# Altium schematic sheet RotaryEncoder_connection.SchDoc
size C; SheetNumber: 2; SheetTotal: 2
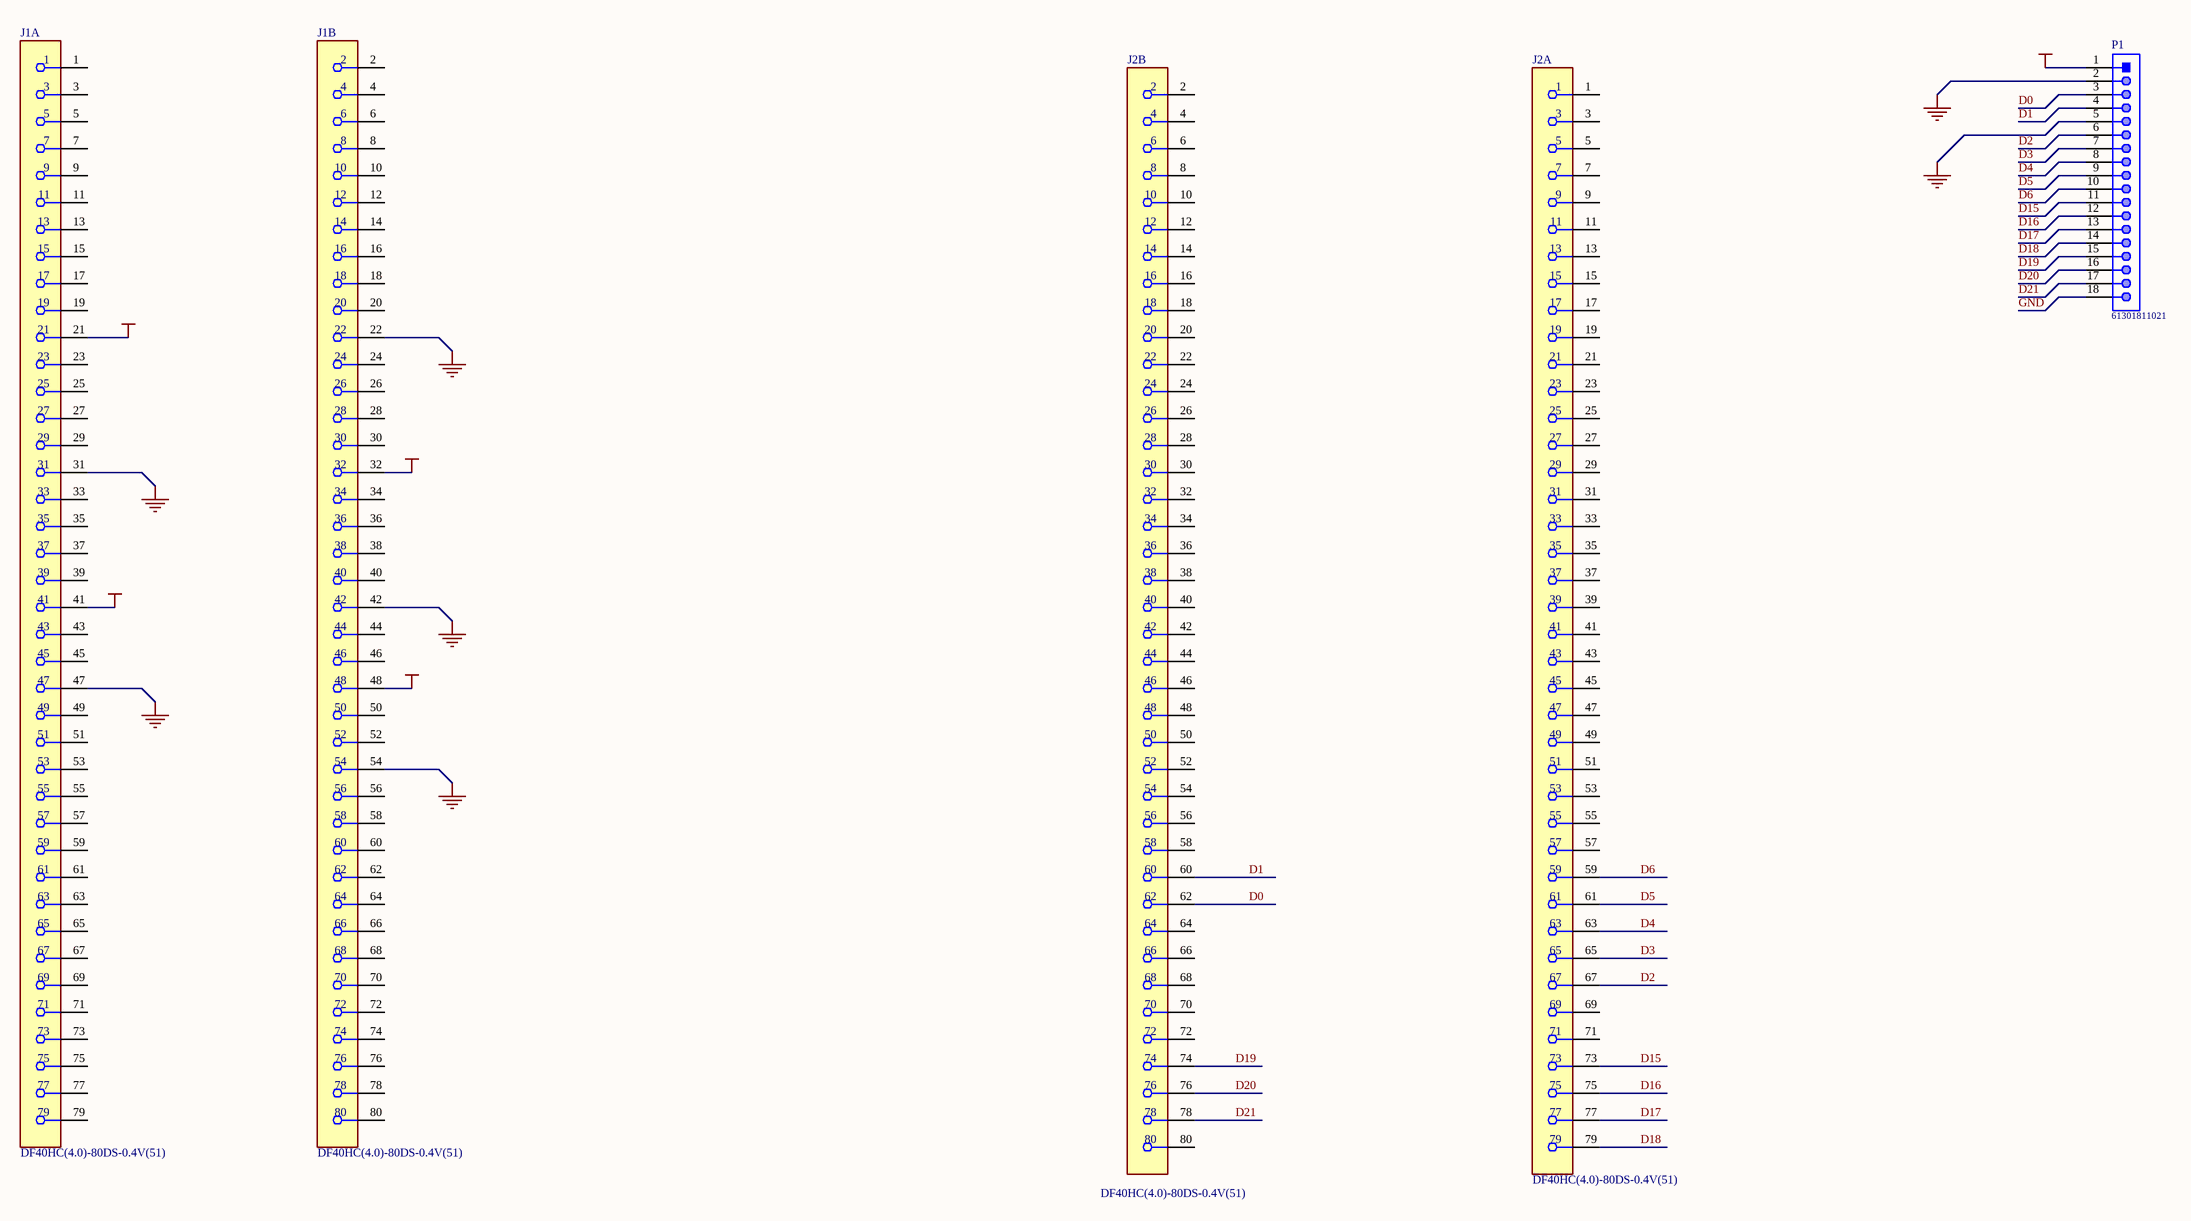
[diagram p0: RotaryEncoder_connection.SchDoc]

## Parts
J1  DF40HC(4.0)-80DS-0.4V(51)  [FP-DF40HC_4_0_-80DS-0_4V-MFG]  (parts A,B of 2)
J2  DF40HC(4.0)-80DS-0.4V(51)  [FP-DF40HC_4_0_-80DS-0_4V-MFG]  (parts A,B of 2)
P1  61301811021  [61301811021]

## Nets
+5: J1.21 J1.32 J1.41 J1.48 P1.1
GND: J1.22 J1.31 J1.42 J1.47 J1.54 P1.2 P1.5 P1.18
D0: J2.62 P1.3
D1: J2.60 P1.4
D2: J2.67 P1.6
D3: J2.65 P1.7
D4: J2.63 P1.8
D5: J2.61 P1.9
D6: J2.59 P1.10
D15: J2.73 P1.11
D16: J2.75 P1.12
D17: J2.77 P1.13
D18: J2.79 P1.14
D19: J2.74 P1.15
D20: J2.76 P1.16
D21: J2.78 P1.17

Not connected (* = marked no-connect by the designer): J1 1 2 3 4 5 6 7 8 9 10 11 12 13 14 15 16 17 18 19 20 23 24 25 26 27 28 29 30 33 34 35 36 37 38 39 40 43 44 45 46 49 50 51 52 53 55 56 57 58 59 60 61 62 63 64 65 66 67 68 69 70 71 72 73 74 75 76 77 78 79 80; J2 1 2 3 4 5 6 7 8 9 10 11 12 13 14 15 16 17 18 19 20 21 22 23 24 25 26 27 28 29 30 31 32 33 34 35 36 37 38 39 40 41 42 43 44 45 46 47 48 49 50 51 52 53 54 55 56 57 58 64 66 68 69 70 71 72 80

## Library data of the parts
J1 J2 = CMP-11605-000021-1: CONN RCPT 80POS SMD GOLD; Manufacturer: Hirose; Current Rating: 0.3A; Is Female: yes; Conn Orientation: Straight; Conn Gender: Female; Standoff Height: 0mm; Number Of Contacts: 80; Pitch: 0.4mm; Voltage Rating: 30V; Lead Free: Yes; Device Class L2: Board to Board Connectors; Mouser Description: Board to Board & Mezzanine Connectors 80P 2 ROW RECEPTACLE 4MM HGHT .4MM PITCH; Temperature Range Low: -35°C; Device Class L3: unset; Footprint Url: https://www.hirose.com/product/document?clcode=CL0684-4140-4-51&productname=DF40HC(4.0)-80DS-0.4V(51)&series=DF40&documenttype=2DDrawing&lang=en&documentid=0001001442; Temperature Range High: +85°C; ComponentLink2Description: Datasheet; Height: 4.05mm; Octopart: https://octopart.com/df40hc%284.0%29-80ds-0.4v%2851%29-hirose-19677719; Package: 0; Contact Material: Gold,Nickel; Device Class L1: Connectors; Automotive: No; Number Of Rows: 2; ComponentLink2URL: https://www.hirose.com/product/document?clcode=CL0684-4140-4-51&productname=DF40HC(4.0)-80DS-0.4V(51)&series=DF40&documenttype=SpecSheet&lang=en&documentid=0000428225; RoHS: TRUE; Category: Conn; Manufacturer Part Number: DF40HC(4.0)-80DS-0.4V(51); Temperature: -35°C to +85°C; Digikey Description: CONN RCPT 80POS SMD GOLD
P1 = CMP-1502-01098-1: THT Angled Pin Header WR-PHD, Pitch 2.54 mm, Single Row, 18 pins; Manufacturer: Wurth Elektronik; Contact Resistance: 20mOhm; Rated Current: 3A; Withstanding Voltage: 500VAC; Pitch: 2.54mm; Pin Number: 18; Gender: Male; Working Voltage: 250VAC; Row Number: Single; Manufacturer URL: http://www.we-online.de; Package Reference: 61301811021; Orientation: Angled; Mounting Technology: THT; Publisher: WurthElektronik; Operating Temperature: -40to105degC; Datasheet URL: https://katalog.we-online.de/em/datasheet/6130xx11021.pdf; Part Number: 61301811021; Packaging: Bag